# EAGLE schematic scooter (EAGLE 4.11)
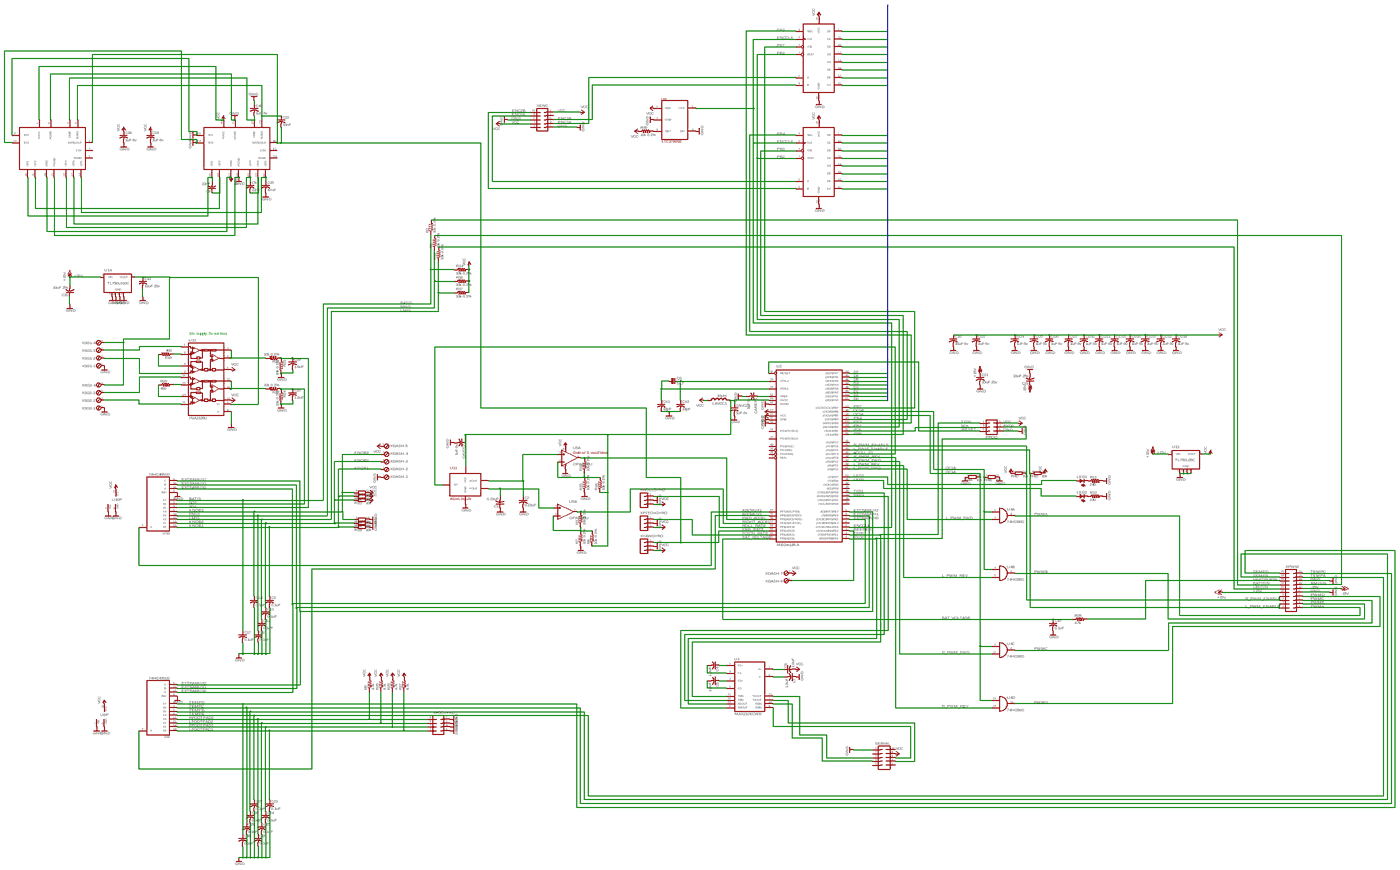
[diagram p0: schematic, sheet 1, overview]
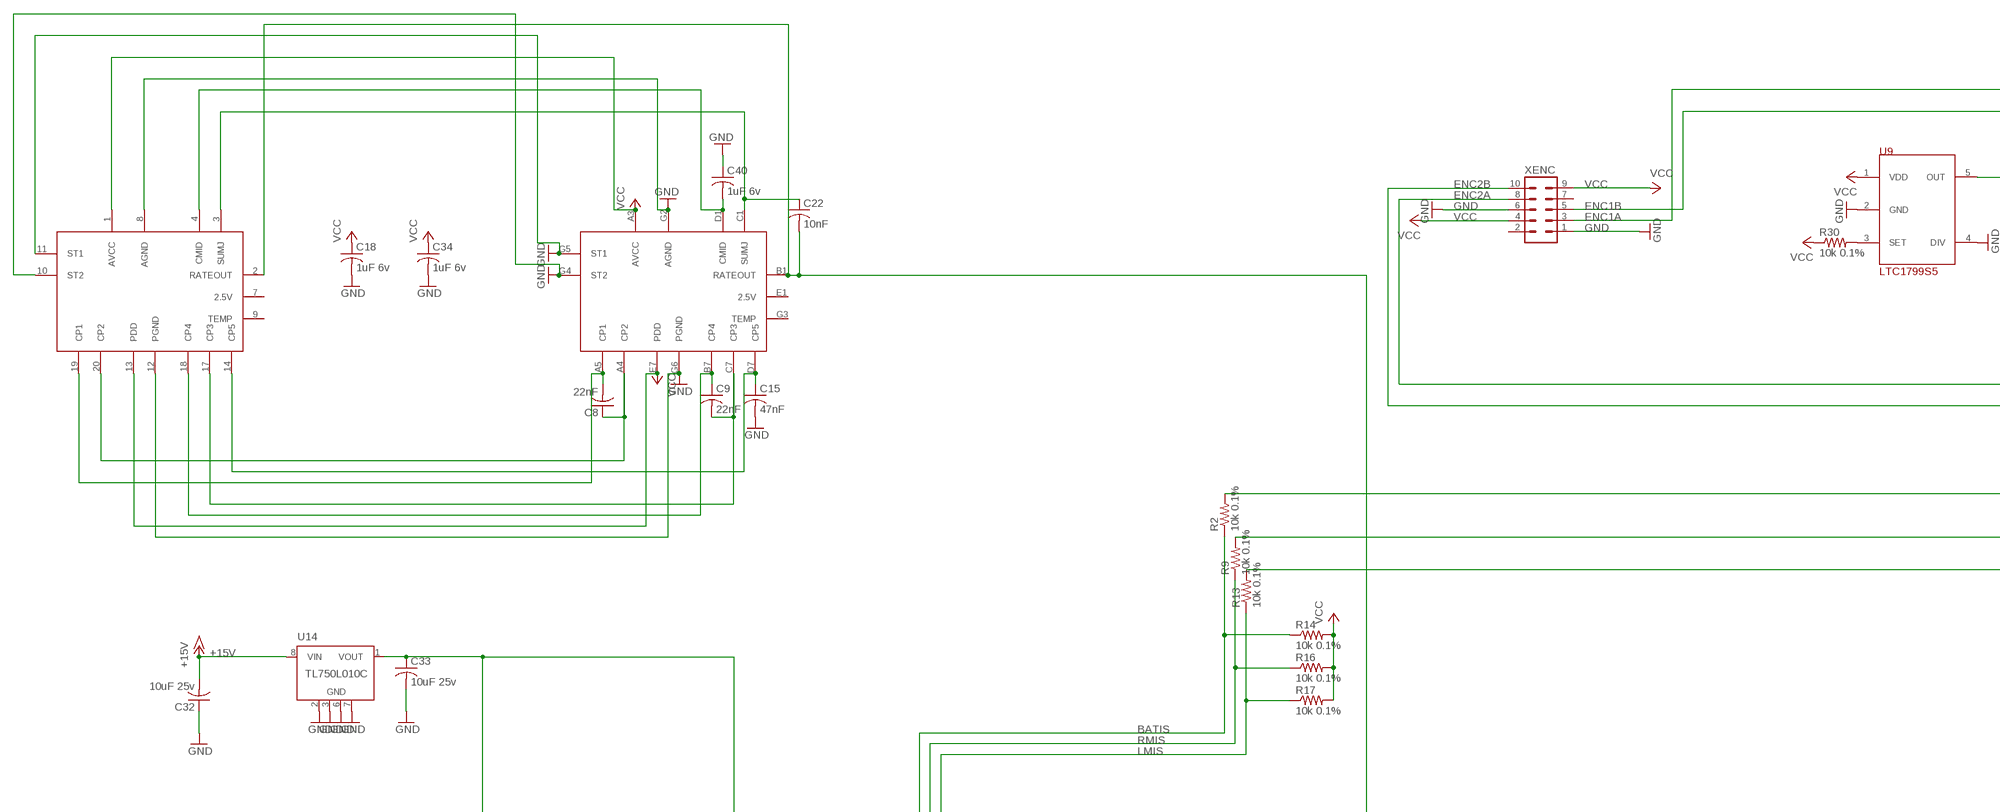
[diagram p1: schematic, sheet 1, part 1 of 4]
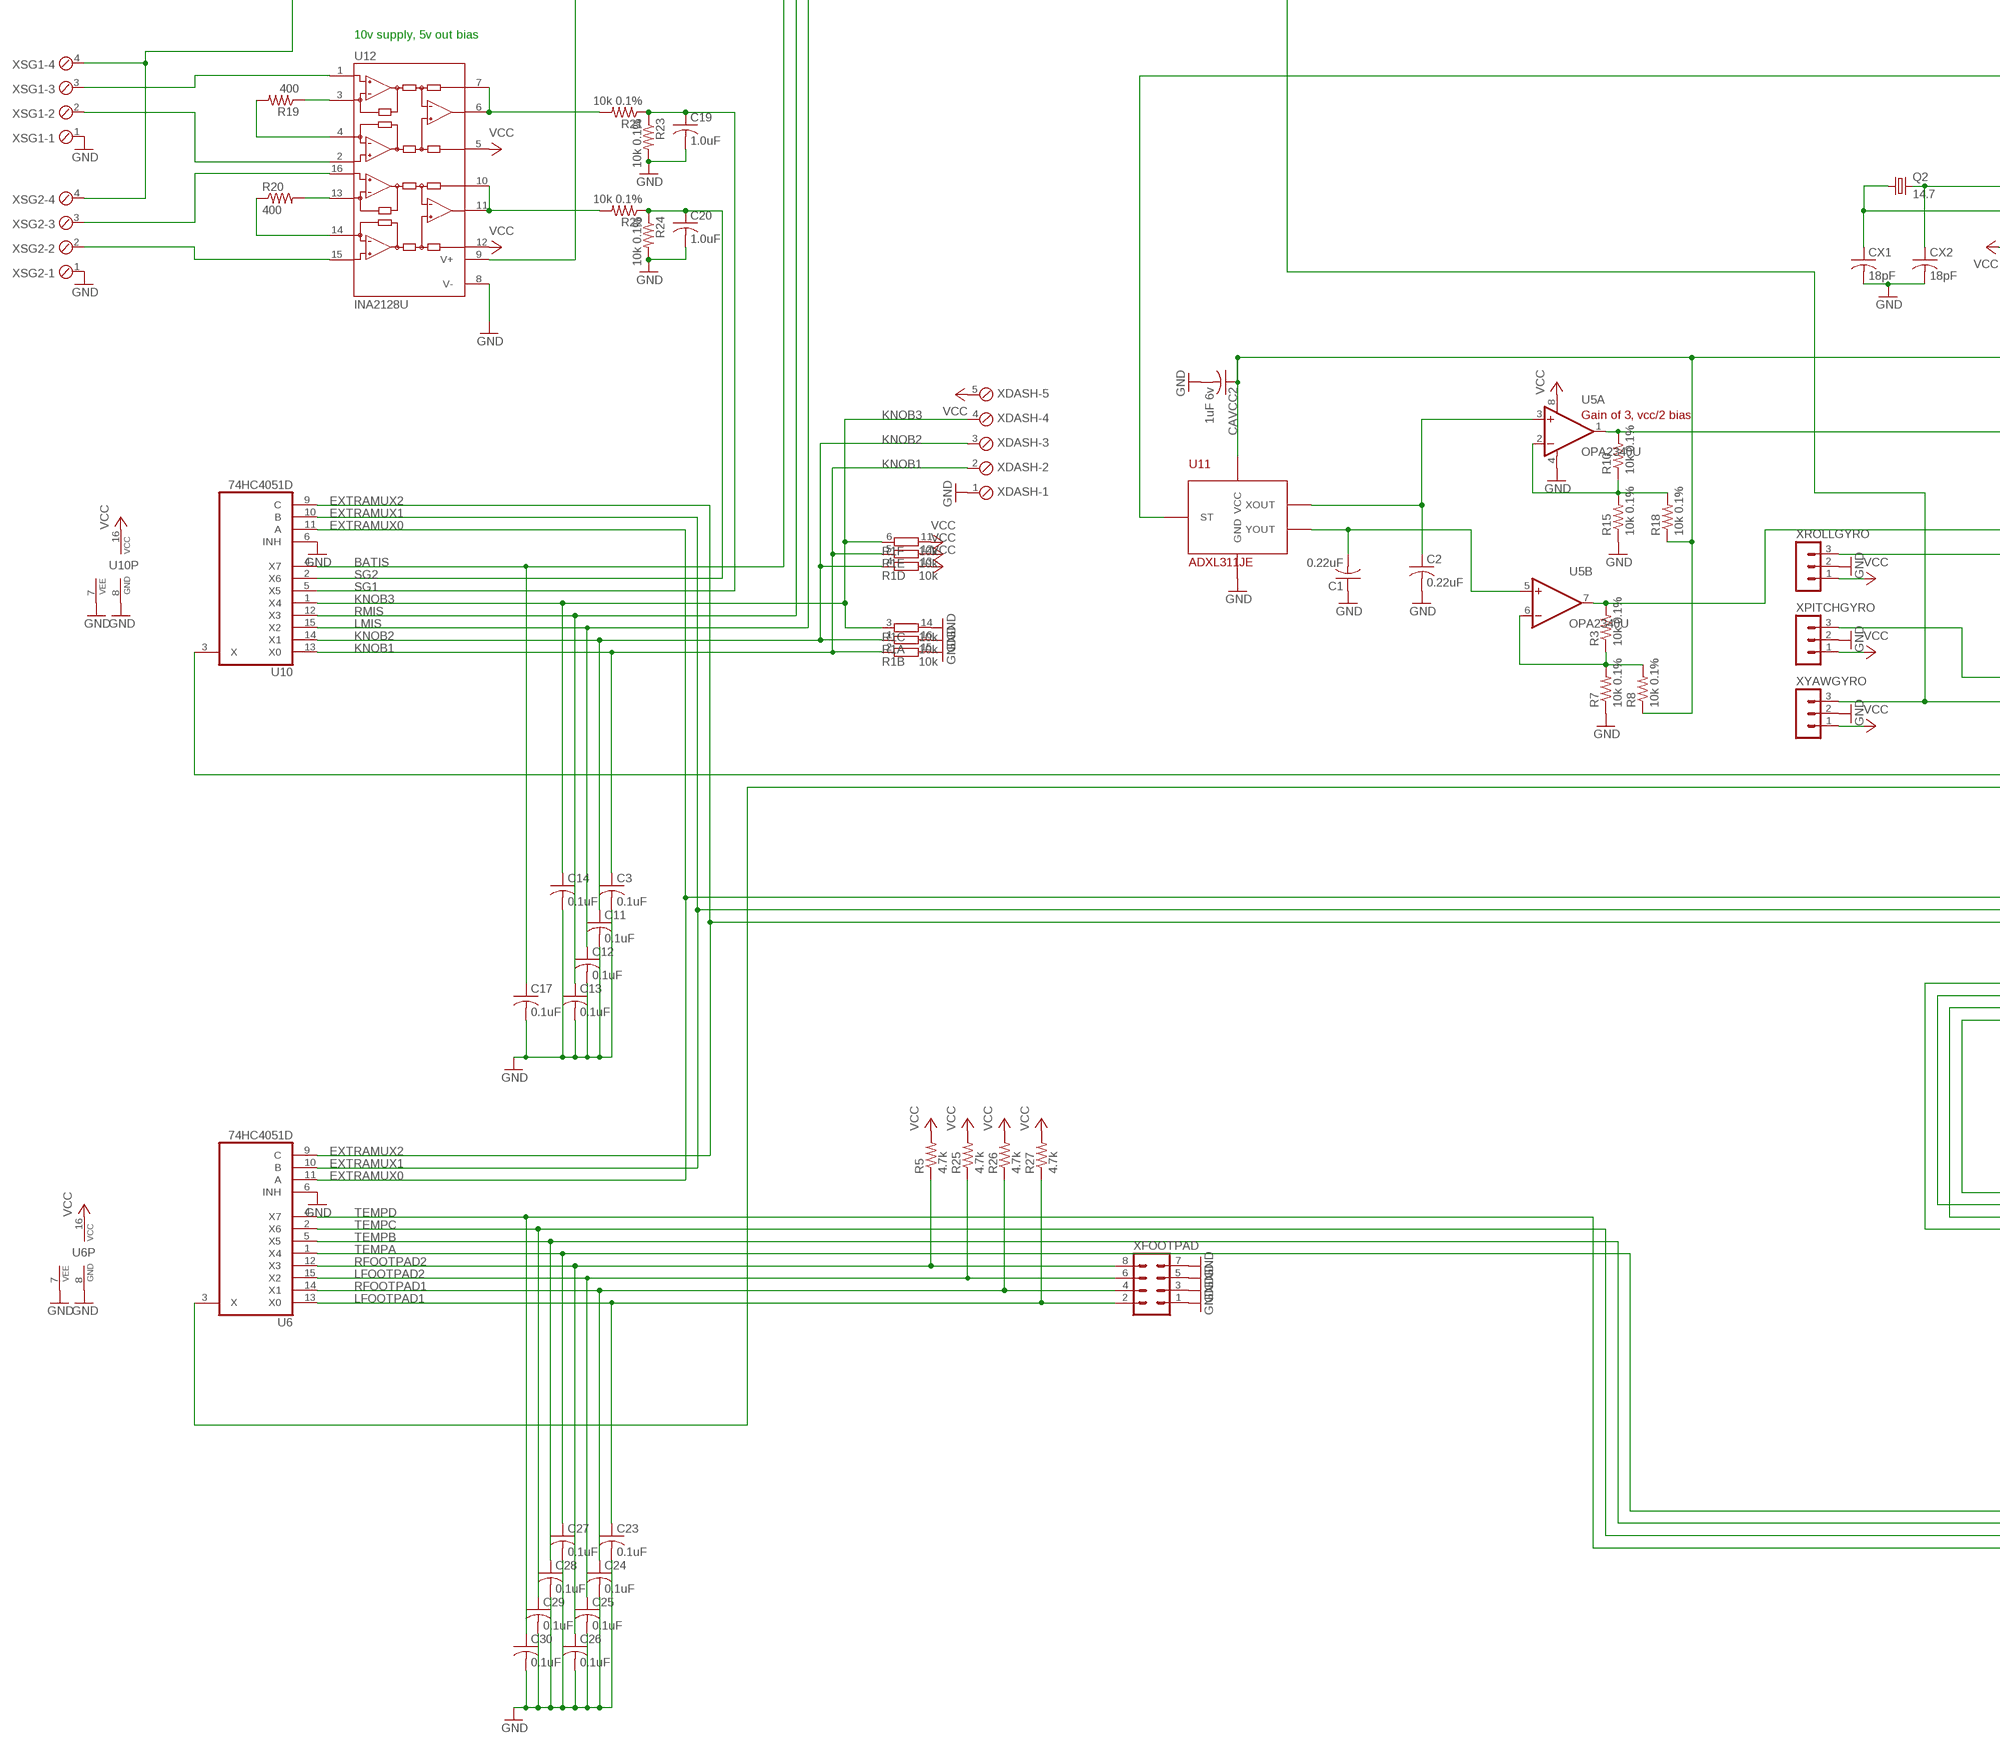
[diagram p2: schematic, sheet 1, part 2 of 4]
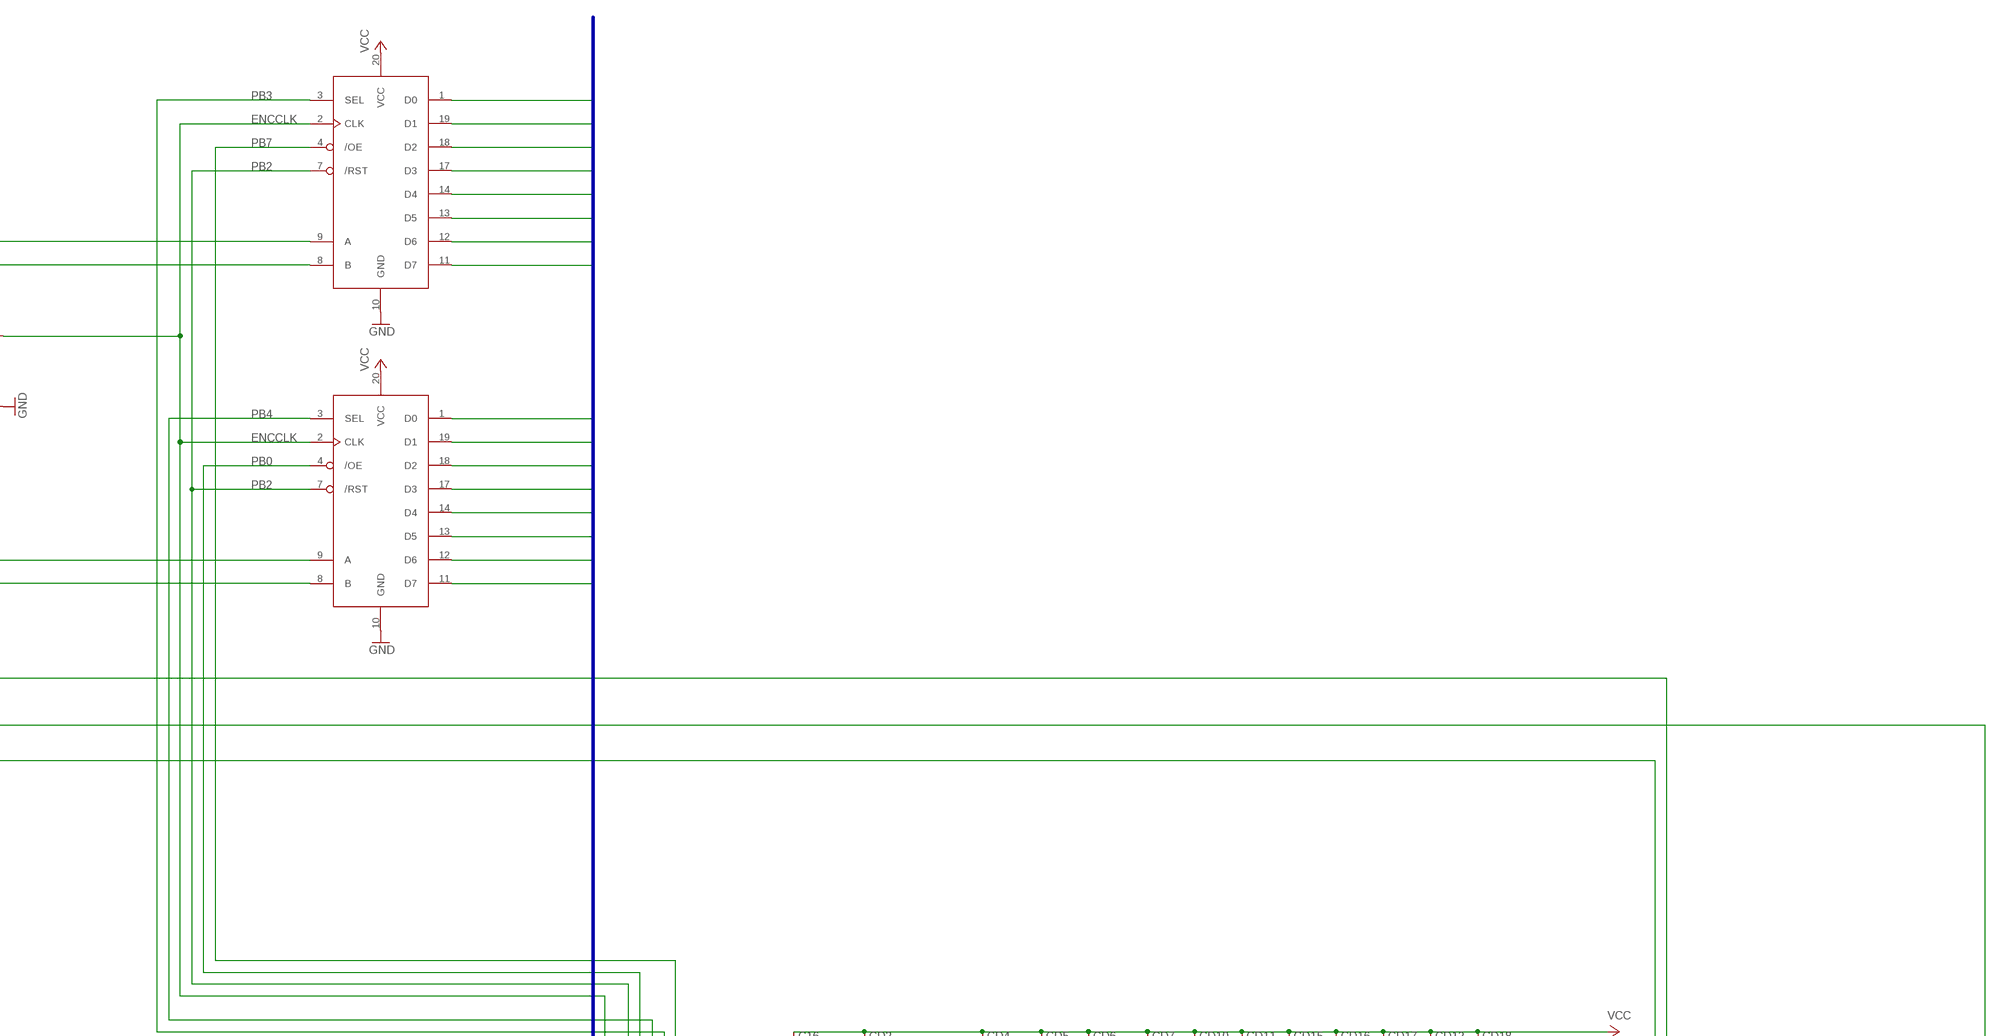
[diagram p3: schematic, sheet 1, part 3 of 4]
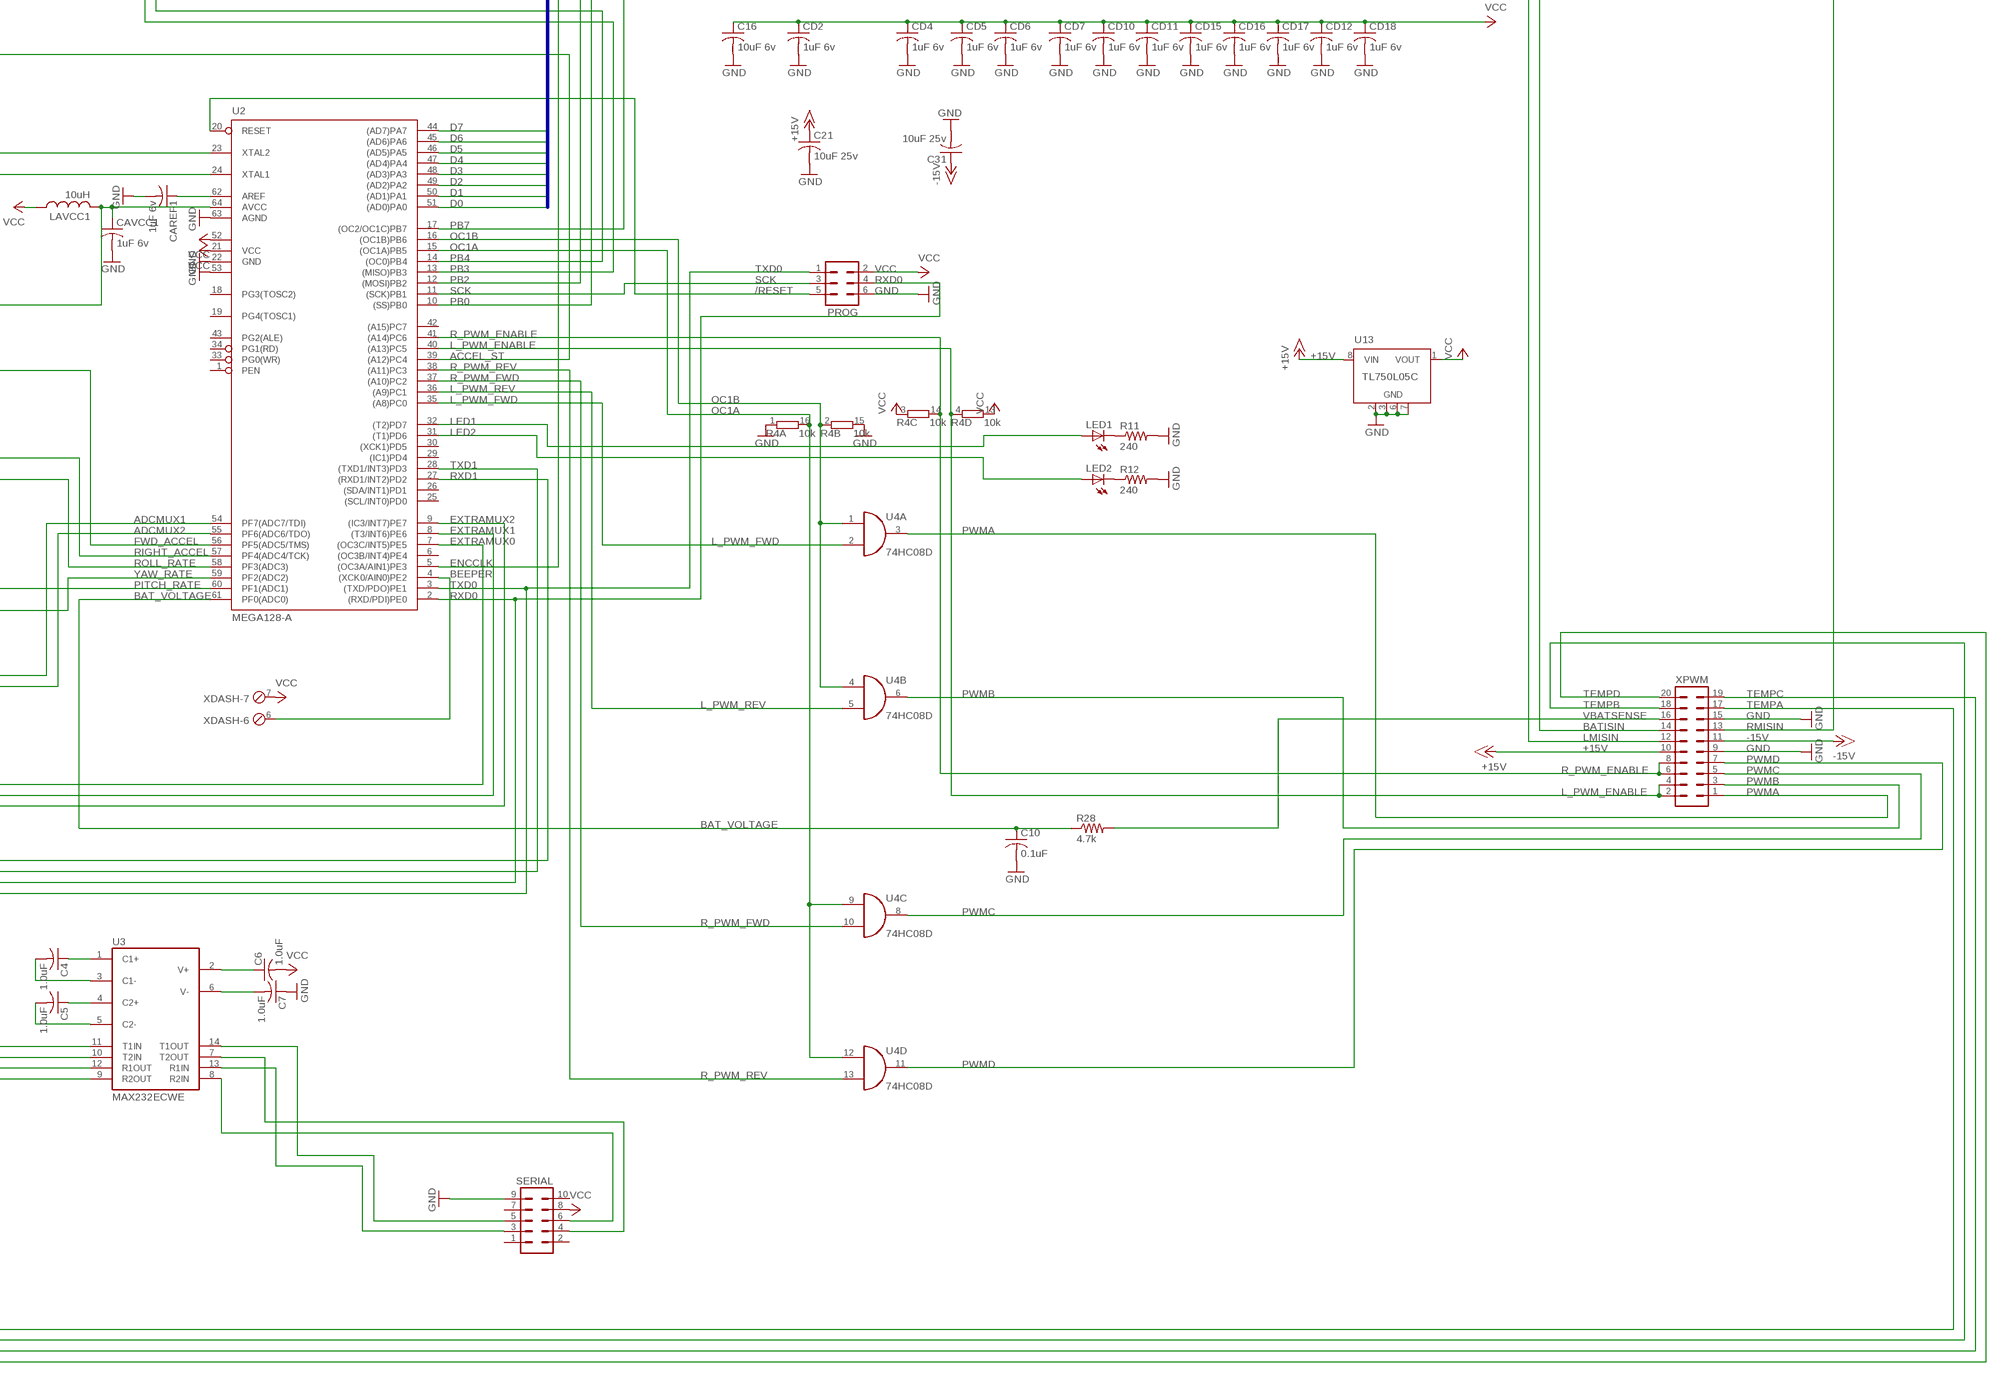
[diagram p4: schematic, sheet 1, part 4 of 4]

## Parts
C1  0.22uF  C-USC0805  [C0805]
C2  0.22uF  C-USC0805  [C0805]
C3  0.1uF  C-USC0805  [C0805]
C4  1.0uF  C-USC0805  [C0805]
C5  1.0uF  C-USC0805  [C0805]
C6  1.0uF  C-USC0805  [C0805]
C7  1.0uF  C-USC0805  [C0805]
C8  22nF  C-USC0402  [C0402]
C9  22nF  C-USC0402  [C0402]
C10  0.1uF  C-USC0805  [C0805]
C11  0.1uF  C-USC0805  [C0805]
C12  0.1uF  C-USC0805  [C0805]
C13  0.1uF  C-USC0805  [C0805]
C14  0.1uF  C-USC0805  [C0805]
C15  47nF  C-USC0402  [C0402]
C16  10uF 6v  C-USC0805  [C0805]
C17  0.1uF  C-USC0805  [C0805]
C18  1uF 6v  C-USC0402  [C0402]
C19  1.0uF  C-USC0805  [C0805]
C20  1.0uF  C-USC0805  [C0805]
C21  10uF 25v  C-USC1206  [C1206]
C22  10nF  C-USC0402  [C0402]
C23  0.1uF  C-USC0805  [C0805]
C24  0.1uF  C-USC0805  [C0805]
C25  0.1uF  C-USC0805  [C0805]
C26  0.1uF  C-USC0805  [C0805]
C27  0.1uF  C-USC0805  [C0805]
C28  0.1uF  C-USC0805  [C0805]
C29  0.1uF  C-USC0805  [C0805]
C30  0.1uF  C-USC0805  [C0805]
C31  10uF 25v  C-USC1206  [C1206]
C32  10uF 25v  C-USC1206  [C1206]
C33  10uF 25v  C-USC1206  [C1206]
C34  1uF 6v  C-USC0402  [C0402]
C40  1uF 6v  C-USC0402  [C0402]
CAREF1  1uF 6v  C-USC0402  [C0402]
CAVCC1  1uF 6v  C-USC0402  [C0402]
CAVCC2  1uF 6v  C-USC0402  [C0402]
CD2  1uF 6v  C-USC0402  [C0402]
CD4  1uF 6v  C-USC0402  [C0402]
CD5  1uF 6v  C-USC0402  [C0402]
CD6  1uF 6v  C-USC0402  [C0402]
CD7  1uF 6v  C-USC0402  [C0402]
CD10  1uF 6v  C-USC0402  [C0402]
CD11  1uF 6v  C-USC0402  [C0402]
CD12  1uF 6v  C-USC0402  [C0402]
CD15  1uF 6v  C-USC0402  [C0402]
CD16  1uF 6v  C-USC0402  [C0402]
CD17  1uF 6v  C-USC0402  [C0402]
CD18  1uF 6v  C-USC0402  [C0402]
CX1  18pF  C-USC0402  [C0402]
CX2  18pF  C-USC0402  [C0402]
LAVCC1  10uH  L-USL2012C  [L2012C]
LED1  LEDCHIP-LED0805  [CHIP-LED0805]
LED2  LEDCHIP-LED0805  [CHIP-LED0805]
PROG  MA03-2  [MA03-2]
Q2  14.7  CRYTALHC49S  [HC49/S]
R1  10k  4816P-T01E  [4816P]
R2  10k 0.1%  R-US_R0805  [R0805]
R3  10k 0.1%  R-US_R0805  [R0805]
R4  10k  4816P-T01E  [4816P]
R5  4.7k  R-US_R0805  [R0805]
R7  10k 0.1%  R-US_R0805  [R0805]
R8  10k 0.1%  R-US_R0805  [R0805]
R9  10k 0.1%  R-US_R0805  [R0805]
R10  10k 0.1%  R-US_R0805  [R0805]
R11  240  R-US_R0805  [R0805]
R12  240  R-US_R0805  [R0805]
R13  10k 0.1%  R-US_R0805  [R0805]
R14  10k 0.1%  R-US_R0805  [R0805]
R15  10k 0.1%  R-US_R0805  [R0805]
R16  10k 0.1%  R-US_R0805  [R0805]
R17  10k 0.1%  R-US_R0805  [R0805]
R18  10k 0.1%  R-US_R0805  [R0805]
R19  400  R-US_R0805  [R0805]
R20  400  R-US_R0805  [R0805]
R21  10k 0.1%  R-US_R0805  [R0805]
R22  10k 0.1%  R-US_R0805  [R0805]
R23  10k 0.1%  R-US_R0805  [R0805]
R24  10k 0.1%  R-US_R0805  [R0805]
R25  4.7k  R-US_R0805  [R0805]
R26  4.7k  R-US_R0805  [R0805]
R27  4.7k  R-US_R0805  [R0805]
R28  4.7k  R-US_R0805  [R0805]
R30  10k 0.1%  R-US_R0805  [R0805]
SERIAL  MA05-2  [MA05-2]
U2  MEGA128-A  [TQFP64]
U3  MAX232ECWE  [SO16L]
U4  74HC08D  [SO14]
U5  OPA2340U  [SO08]
U6  74HC4051D  4051D  [SO16]
U7  HCTL-2016#PLC  [PLCC20]
U8  HCTL-2016#PLC  [PLCC20]
U9  LTC1799S5  [SOT23-5L]
U10  74HC4051D  4051D  [SO16]
U11  ADXL311JE  [E-8]
U12  INA2128U  [SO16-1]
U13  TL750L05C  78L05SMD  [SO08]
U14  TL750L010C  78L08SMD  [SO08]
U15  ADXRS150ABG  [BC-32]
U16  ADXRS150ABGEB  [DIL20]
XDASH  MPT7  [7POL254]
XENC  MA05-2  [MA05-2]
XFOOTPAD  MA04-2  [MA04-2]
XPITCHGYRO  MA03-1  [MA03-1]
XPWM  MA10-2  [MA10-2]
XROLLGYRO  MA03-1  [MA03-1]
XSG1  MPT4  [4POL254]
XSG2  MPT4  [4POL254]
XYAWGYRO  MA03-1  [MA03-1]

## Nets
+15V [pwr]: C21.1 C32.2 U13.8(VIN) U14.8(VIN) XPWM.10
-15V [pwr]: C31.1 XPWM.11
/RESET: PROG.5 U2.20(RESET)
ACCEL_ST: U2.39((A12)PC4) U11.1(ST)
ADCMUX1: U2.54(PF7(ADC7/TDI)) U10.3(X)
ADCMUX2: U2.55(PF6(ADC6/TDO)) U6.3(X)
AREF: CAREF1.1 U2.62(AREF)
AVCC: CAVCC1.1 CAVCC2.1 LAVCC1.2 R8.1 R18.1 U2.64(AVCC) U11.8(VCC)
BAT_VOLTAGE: C10.1 R28.1 U2.61(PF0(ADC0))
BATIS: C17.1 R2.1 R14.1 U10.4(X7)
BATISIN: R2.2 XPWM.14
BEEPER: U2.4((XCK0/AIN0)PE2) XDASH.6
D0: U2.51((AD0)PA0) U7.1(D0) U8.1(D0)
D1: U2.50((AD1)PA1) U7.19(D1) U8.19(D1)
D2: U2.49((AD2)PA2) U7.18(D2) U8.18(D2)
D3: U2.48((AD3)PA3) U7.17(D3) U8.17(D3)
D4: U2.47((AD4)PA4) U7.14(D4) U8.14(D4)
D5: U2.46((AD5)PA5) U7.13(D5) U8.13(D5)
D6: U2.45((AD6)PA6) U7.12(D6) U8.12(D6)
D7: U2.44((AD7)PA7) U7.11(D7) U8.11(D7)
ENC1A: U7.9(A) XENC.3
ENC1B: U7.8(B) XENC.5
ENC2A: U8.9(A) XENC.8
ENC2B: U8.8(B) XENC.10
ENCCLK: U2.5((OC3A/AIN1)PE3) U7.2(CLK) U8.2(CLK) U9.5(OUT)
EXTRAMUX0: U2.7((OC3C/INT5)PE5) U6.11(A) U10.11(A)
EXTRAMUX1: U2.8((T3/INT6)PE6) U6.10(B) U10.10(B)
EXTRAMUX2: U2.9((IC3/INT7)PE7) U6.9(C) U10.9(C)
FWD_ACCEL: R10.2 U2.56(PF5(ADC5/TMS)) U5.1(A:OUT)
GND [pwr]: C1.1 C2.2 C3.2 C7.1 C10.2 C11.2 C12.2 C13.2 C14.2 C15.2 C16.2 C17.2 C18.2 C19.2 C20.2 C21.2 C23.2 C24.2 C25.2 C26.2 C27.2 C28.2 C29.2 C30.2 C31.2 C32.1 C33.2 C34.2 C40.1 CAREF1.2 CAVCC1.2 CAVCC2.2 CD2.2 CD4.2 CD5.2 CD6.2 CD7.2 CD10.2 CD11.2 CD12.2 CD15.2 CD16.2 CD17.2 CD18.2 CX1.2 CX2.2 PROG.6 R1.14 R1.15 R1.16 R4.1 R4.15 R7.1 R11.2 R12.2 R15.1 R23.2 R24.2 SERIAL.9 U2.22(GND) U2.53(GND1) U2.63(AGND) U5.4(A:V-) U6.6(INH) U6.7(VEE) U6.8(GND) U7.10(GND) U8.10(GND) U9.2(GND) U9.4(DIV) U10.6(INH) U10.7(VEE) U10.8(GND) U11.3(GND) U12.8(V-) U13.2(GND) U13.3(GND) U13.6(GND) U13.7(GND) U14.2(GND) U14.3(GND) U14.6(GND) U14.7(GND) U15.G2(AGND) U15.G4(ST2) U15.G5(ST1) U15.G6(PGND) U16.8(AGND) U16.10(ST2) U16.11(ST1) U16.12(PGND) XDASH.1 XENC.1 XENC.6 XFOOTPAD.1 XFOOTPAD.3 XFOOTPAD.5 XFOOTPAD.7 XPITCHGYRO.2 XPWM.9 XPWM.15 XROLLGYRO.2 XSG1.1 XSG2.1 XYAWGYRO.2
KNOB1: C3.1 R1.2 R1.5 U10.13(X0) XDASH.2
KNOB2: C11.1 R1.1 R1.4 U10.14(X1) XDASH.3
KNOB3: C14.1 R1.3 R1.6 U10.1(X4) XDASH.4
L_PWM_ENABLE: R4.4 U2.40((A13)PC5) XPWM.2 XPWM.4
L_PWM_FWD: U2.35((A8)PC0) U4.2(A:I1)
L_PWM_REV: U2.36((A9)PC1) U4.5(B:I1)
LED1: LED1.A U2.32((T2)PD7)
LED2: LED2.A U2.31((T1)PD6)
LFOOTPAD1: C23.1 R27.1 U6.13(X0) XFOOTPAD.2
LFOOTPAD2: C25.1 R25.1 U6.15(X2) XFOOTPAD.6
LMIS: C12.1 R13.1 R17.1 U10.15(X2)
LMISIN: R13.2 XPWM.12
MCUXTAL1: CX1.1 Q2.1 U2.24(XTAL1)
MCUXTAL2: CX2.1 Q2.2 U2.23(XTAL2)
N$1: R19.1 U12.3(RGA)
N$2: R30.2 U9.3(SET)
N$3: C2.1 U5.3(A:+IN) U11.7(XOUT)
N$4: C1.2 U5.5(B:+IN) U11.6(YOUT)
N$5: R3.1 R7.2 R8.2 U5.6(B:-IN)
N$6: R10.1 R15.2 R18.2 U5.2(A:-IN)
N$7: C40.2 U15.D1(CMID) U16.4(CMID)
N$8: R21.2 U12.6(VOA) U12.7(SENSEA)
N$9: R22.2 U12.10(SENSEB) U12.11(VOB)
N$10: R19.2 U12.4(RGA)
N$11: C4.1 U3.1(C1+)
N$12: C5.1 U3.4(C2+)
N$13: R20.2 U12.13(RGB)
N$14: LED1.C R11.1
N$15: R20.1 U12.14(RGB)
N$16: LED2.C R12.1
N$17: U12.1(INA-) XSG1.3
N$18: U12.2(INA+) XSG1.2
N$19: U12.16(INB-) XSG2.3
N$20: C5.2 U3.5(C2-)
N$21: U12.15(INB+) XSG2.2
N$22: C4.2 U3.3(C1-)
N$23: C9.1 U15.B7(CP4) U16.18(CP4)
N$24: C6.1 U3.2(V+)
N$25: C9.2 U15.C7(CP3) U16.17(CP3)
N$26: C7.2 U3.6(V-)
N$27: C8.2 U15.A5(CP1) U16.19(CP1)
N$28: C8.1 U15.A4(CP2) U16.20(CP2)
N$29: C15.1 U15.D7(CP5) U16.14(CP5)
N$30: C22.1 U15.C1(SUMJ) U16.3(SUMJ)
N$33: SERIAL.5 U3.14(T1OUT)
N$34: SERIAL.3 U3.13(R1IN)
N$35: SERIAL.4 U3.7(T2OUT)
N$36: SERIAL.6 U3.8(R2IN)
OC1A: R4.16 U2.15((OC1A)PB5) U4.9(C:I0) U4.12(D:I0)
OC1B: R4.2 U2.16((OC1B)PB6) U4.1(A:I0) U4.4(B:I0)
PB0: U2.10((SS)PB0) U8.4(/OE)
PB2: U2.12((MOSI)PB2) U7.7(/RST) U8.7(/RST)
PB3: U2.13((MISO)PB3) U7.3(SEL)
PB4: U2.14((OC0)PB4) U8.3(SEL)
PB7: U2.17((OC2/OC1C)PB7) U7.4(/OE)
PITCH_RATE: U2.60(PF1(ADC1)) XPITCHGYRO.3
PWMA: U4.3(A:O) XPWM.1
PWMB: U4.6(B:O) XPWM.3
PWMC: U4.8(C:O) XPWM.5
PWMD: U4.11(D:O) XPWM.7
R_PWM_ENABLE: R4.14 U2.41((A14)PC6) XPWM.6 XPWM.8
R_PWM_FWD: U2.37((A10)PC2) U4.10(C:I1)
R_PWM_REV: U2.38((A11)PC3) U4.13(D:I1)
RFOOTPAD1: C24.1 R26.1 U6.14(X1) XFOOTPAD.4
RFOOTPAD2: C26.1 R5.1 U6.12(X3) XFOOTPAD.8
RIGHT_ACCEL: R3.2 U2.57(PF4(ADC4/TCK)) U5.7(B:OUT)
RMIS: C13.1 R9.1 R16.1 U10.12(X3)
RMISIN: R9.2 XPWM.13
ROLL_RATE: U2.58(PF3(ADC3)) XROLLGYRO.3
RXD0: PROG.4 U2.2((RXD/PDI)PE0) U3.12(R1OUT)
RXD1: U2.27((RXD1/INT2)PD2) U3.9(R2OUT)
SCK: PROG.3 U2.11((SCK)PB1)
SG1: C19.1 R21.1 R23.1 U10.5(X5)
SG2: C20.1 R22.1 R24.1 U10.2(X6)
SGPWR: C33.1 U12.9(V+) U14.1(VOUT) XSG1.4 XSG2.4
TEMPA: C27.1 U6.1(X4) XPWM.17
TEMPB: C28.1 U6.5(X5) XPWM.18
TEMPC: C29.1 U6.2(X6) XPWM.19
TEMPD: C30.1 U6.4(X7) XPWM.20
TXD0: PROG.1 U2.3((TXD/PDO)PE1) U3.11(T1IN)
TXD1: U2.28((TXD1/INT3)PD3) U3.10(T2IN)
VBATSENSE: R28.2 XPWM.16
VCC [pwr]: C6.2 C16.1 C18.1 C34.1 CD2.1 CD4.1 CD5.1 CD6.1 CD7.1 CD10.1 CD11.1 CD12.1 CD15.1 CD16.1 CD17.1 CD18.1 LAVCC1.1 PROG.2 R1.11 R1.12 R1.13 R4.3 R4.13 R5.2 R14.2 R16.2 R17.2 R25.2 R26.2 R27.2 R30.1 SERIAL.8 U2.21(VCC) U2.52(VCC1) U5.8(A:V+) U6.16(VCC) U7.20(VCC) U8.20(VCC) U9.1(VDD) U10.16(VCC) U12.5(REFA) U12.12(REFB) U13.1(VOUT) U15.A3(AVCC) U15.E7(PDD) U16.1(AVCC) U16.13(PDD) XDASH.5 XDASH.7 XENC.4 XENC.9 XPITCHGYRO.1 XROLLGYRO.1 XYAWGYRO.1
YAW_RATE: C22.2 U2.59(PF2(ADC2)) U15.B1(RATEOUT) U16.2(RATEOUT) XYAWGYRO.3
Unconnected: R1.7 R1.8 R1.9 R1.10 R4.5 R4.6 R4.7 R4.8 R4.9 R4.10 R4.11 R4.12 SERIAL.1 SERIAL.2 SERIAL.7 SERIAL.10 U2.1(PEN) U2.6((OC3B/INT4)PE4) U2.18(PG3(TOSC2)) U2.19(PG4(TOSC1)) U2.25((SCL/INT0)PD0) U2.26((SDA/INT1)PD1) U2.29((IC1)PD4) U2.30((XCK1)PD5) U2.33(PG0(WR)) U2.34(PG1(RD)) U2.42((A15)PC7) U2.43(PG2(ALE)) U13.4(NC) U13.5(NC) U14.4(NC) U14.5(NC) U15.E1(2.5V) U15.G3(TEMP) U16.7(2.5V) U16.9(TEMP) XENC.2 XENC.7

## Buses
D[0..7]

## Notes on the sheet
- 10v supply, 5v out bias
- Gain of 3, vcc/2 bias

## Power pins joined to a net without a drawn wire
GND: U3.15(GND) U4.7(P:GND)
VCC: U3.16(VCC) U4.14(P:VCC)

## Library data of the parts
C1-C34 C40 CAREF1 CAVCC1 CAVCC2 CD2 CD4-CD7 CD10-CD12 CD15-CD18 CX1 CX2 = rcl:C-US: CAPACITOR, American symbol
LAVCC1 = rcl:L-US: INDUCTOR, American symbol
LED1 LED2 = led:LED: LED OSRAM: - CHIPLED LG R971, LG N971, LY N971, LG Q971, LY Q971, LO R971, LY R971 LH N974, LH R974 LS Q976, LO Q976, LY Q976 LO Q996 - Hyper CHIPLED LW Q18S LB Q993, LB Q99A, LB R99A - SideLED LS A670, LO A670, LY A670, LG A670, LP A670 LB A673, LV A673, LT A673, LW A673 LH A674 LY A675 LS A676, LA A676, LO A676, LY A676, LW A676 LS A679, LY A679, LG A679 - Hyper Micro SIDELED® LS Y876, LA Y876, LO Y876, LY Y876 LT Y87S - SmartLED LW L88C, LW L88S LB L89C, LB L89S, LG L890 LS L89K, LO L89K, LY L89K LS L896, LA L896, LO L896, LY L896 - TOPLED LS T670, LO T670, LY T670, LG T670, LP T670 LSG T670, LSP T670, LSY T670, LOP T670, LYG T670 LG T671, LOG T671, LSG T671 LB T673, LV T673, LT T673, LW T673 LH T674 LS T676, LA T676, LO T676, LY T676, LB T676, LH T676, LSB T676, LW T676 LB T67C, LV T67C, LT T67C, LS T67K, LO T67K, LY T67K, LW E67C LS E67B, LA E67B, LO E67B, LY E67B, LB E67C, LV E67C, LT E67C LW T67C LS T679, LY T679, LG T679 LS T770, LO T770, LY T770, LG T770, LP T770 LB T773, LV T773, LT T773, LW T773 LH T774 LS E675, LA E675, LY E675, LS T675 LS T776, LA T776, LO T776, LY T776, LB T776 LHGB T686 LT T68C, LB T68C - Hyper Mini TOPLED® LB M676 - Mini TOPLED Santana® LG M470 LS M47K, LO M47K, LY M47K Source: http://www.osram.convergy.de/
PROG = con-lstb:MA03-2: PIN HEADER
Q2 = crystal:CRYTAL: CRYSTAL
R1 R4 = resistor-bourns:4816P-T01E: BOURNS RESISTOR NETWORK
R2 R3 R5 R7-R28 R30 = rcl:R-US_: RESISTOR, American symbol
SERIAL XENC = con-lstb:MA05-2: PIN HEADER
U2 = avr:MEGA128: MICROCONTROLLER 128 Kbytes FLASH 4 Kbytes SRAM 4 Kbytes EEPROM DUAL USART 8-channel 10 bit ADC
U3 = maxim:MAX232ECWE: RS232 TRANSEIVER
U4 = 74xx-eu:74*08: Quad 2-input AND gate
U5 = burr-brown:OPA2340: Single-Supply, Rail-to-Rail Operational Amplifiers MicroAmplifier(TM) Series; Product Folder:OPA2340
U6 U10 = 40xx:4051: 8-channel ANALOG MULTIPLEXER
U7 U8 = tlb:HCTL-2016#PLC
U9 = tlb:LTC1799
U11 = tlb:ADXL311JE
U12 = burr-brown:INA2128: Dual Instrumentation Amplifier Low Power
U13 U14 = linear:78L*SMD: Positive VOLTAGE REGULATOR
U15 U16 = tlb:ADXRS150ABG
XDASH = con-phoenix-254:MPT7: PHOENIX CONNECTOR
XFOOTPAD = con-lstb:MA04-2: PIN HEADER
XPITCHGYRO XROLLGYRO XYAWGYRO = con-lstb:MA03-1: PIN HEADER
XPWM = con-lstb:MA10-2: PIN HEADER
XSG1 XSG2 = con-phoenix-254:MPT4: PHOENIX CONNECTOR

## Net classes
1 pwr: width 0.254 mm
2 bigpwr: width 0.914 mm, clearance 0.813 mm
3 ugpwr: width 0.61 mm, clearance 0.61 mm